# EasyEDA Pro project v_da-detector-v2.epro

# Schematic Schematic1
Board Name: Board1; Create Date: 2025-02-13; Page Name: P1; Project Name: v_da-detector; Schematic Name: Schematic1; Update Date: 2025-03-17; Company: EasyEDA.com; Page Size: A4; Version: V1.0
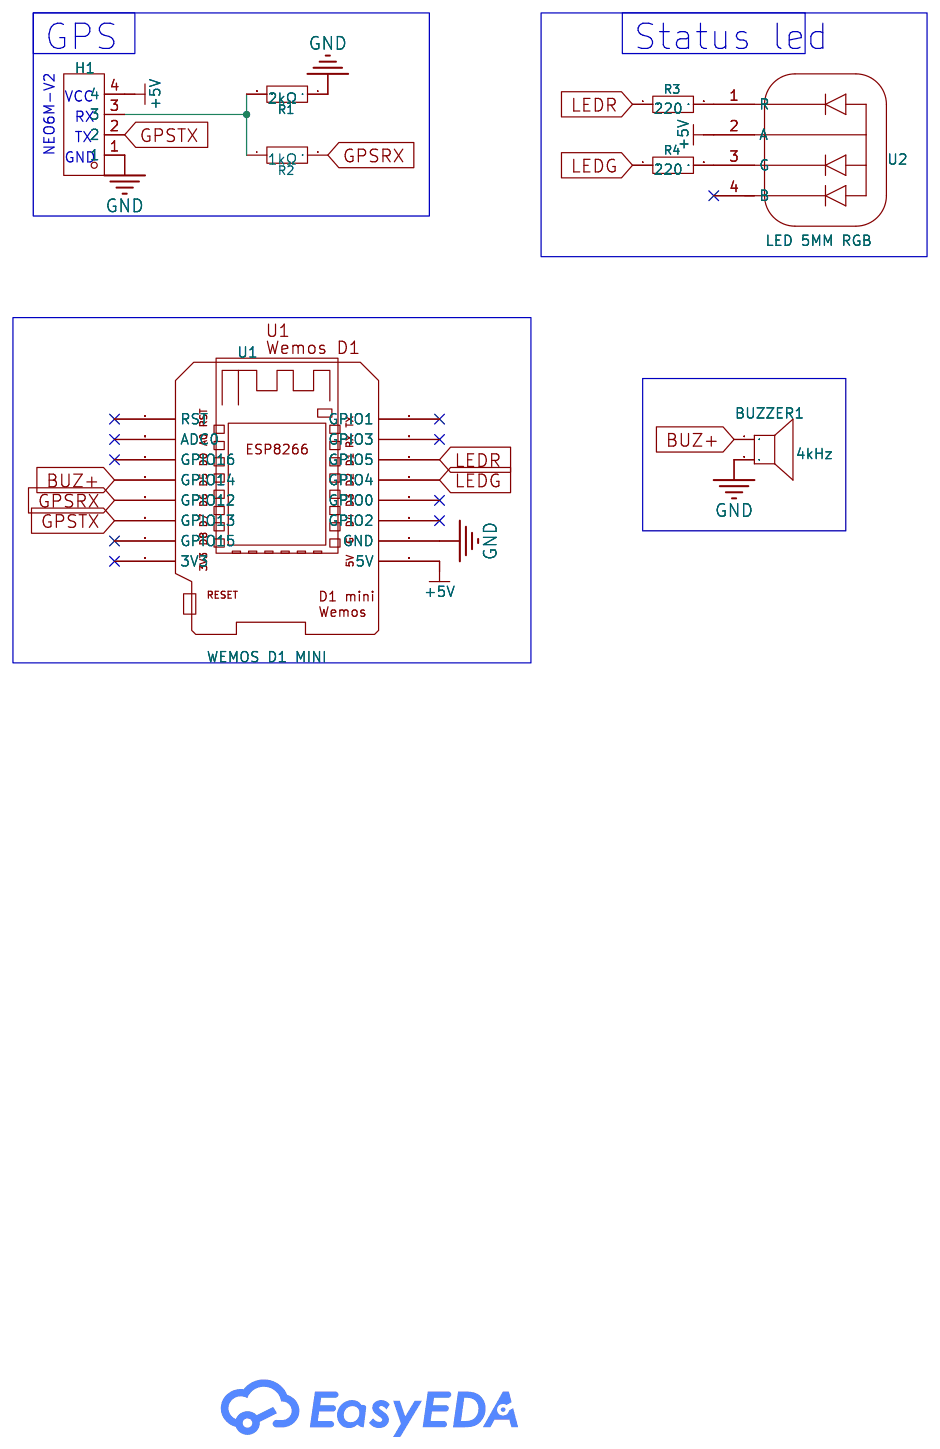
[diagram p0: schematic sheet]

## Parts
BUZZER1  4kHz  [BUZ-TH_BD12.5-P6.50-D0.9]
H1  -  [HDR-TH_4P-P2.54-V-M]
R1  2kΩ  [R0805]
R2  1kΩ  [R0805]
R3  220  [R0805]
R4  220  [R0805]
U1  WEMOS D1 MINI  [WEMOS-D1-MINI]
U2  LED 5MM RGB  [LED 5MM RGB TH]

## Library data of the parts
BUZZER1 = SFN-1207PA6.5: Driver Circuitry:Passive (external drive) Technology:Piezoelectric Frequency:4kHz Sound Pressure Level(SPL):80dB Diameter(φD):12.5mm Height:6.8mm; LCSC Part Name: 压电无源蜂鸣器; Supplier Part: C360618; Manufacturer: S&S(海旭); Supplier Footprint: 插件,D=12.5mm; JLCPCB Part Class: Extended Part; Datasheet: https://atta.szlcsc.com/upload/public/pdf/source/20190422/C360618_7771100601F1897510FDBBB3D1D2D84A.pdf; Supplier: LCSC; Driver Circuitry: Passive (external drive); Technology: Piezoelectric; Sound Pressure Level(SPL): 80dB; Diameter(φD): 12.5mm; Height: 6.8mm
H1 = HDR-M_2.54_1x4P: Supplier Footprint: Through
R1-R4 = 0805W8F1002T5E: Type:Thick Film Resistors Resistance:10kΩ Tolerance:±1% Tolerance:±1% Power(Watts): Overload Voltage (Max): Temperature Coefficient:±100ppm/℃ Temperature Coefficient:±100ppm/℃ Operating Temperature Range:-55℃~+155℃ Operating Temperature Range:-55℃~+155℃; LCSC Part Name: 10kΩ ±1% 125mW 厚膜电阻; Supplier Part: C17414; Manufacturer: UNI-ROYAL(厚声); Supplier Footprint: 0805; JLCPCB Part Class: Basic Part; Datasheet: https://atta.szlcsc.com/upload/public/pdf/source/20200306/C422600_1E6D84923E4A46A82E41ADD87F860B5C.pdf; Supplier: LCSC; Type: Thick Film Resistors; Tolerance: ±1%; Temperature Coefficient: ±100ppm/℃; Operating Temperature Range: -55℃~+155℃
U1 = WEMOS D1 MINI
U2 = LED 5MM RGB: Mounted: Yes

## Nets
+5V: H1.4 U1.5V U2.2(A)
GND: BUZZER1.2 H1.1 R1.1 U1.GND
BUZ+: BUZZER1.1 U1.D5(GPIO14)
GPSRX: R2.2 U1.D6(GPIO12)
GPSTX: H1.2 U1.D7(GPIO13)
LEDG: R4.1 U1.D2(GPIO4)
LEDR: R3.1 U1.D1(GPIO5)
Net-(H1-3): H1.3 R1.2 R2.1
Net-(R3-2): R3.2 U2.1(R)
Net-(R4-2): R4.2 U2.3(G)

Not connected (* = marked no-connect by the designer): U1 3V3* A0(ADC0)* D0(GPIO16)* D3(GPIO0)* D4(GPIO2)* D8(GPIO15)* RST* RX(GPIO3)* TX(GPIO1)*; U2 4(B)*

## Notes on the sheet
- GPS
- Status led
- NEO6M-V2
- VCC
- RX
- GND
- TX

# Board PCB2
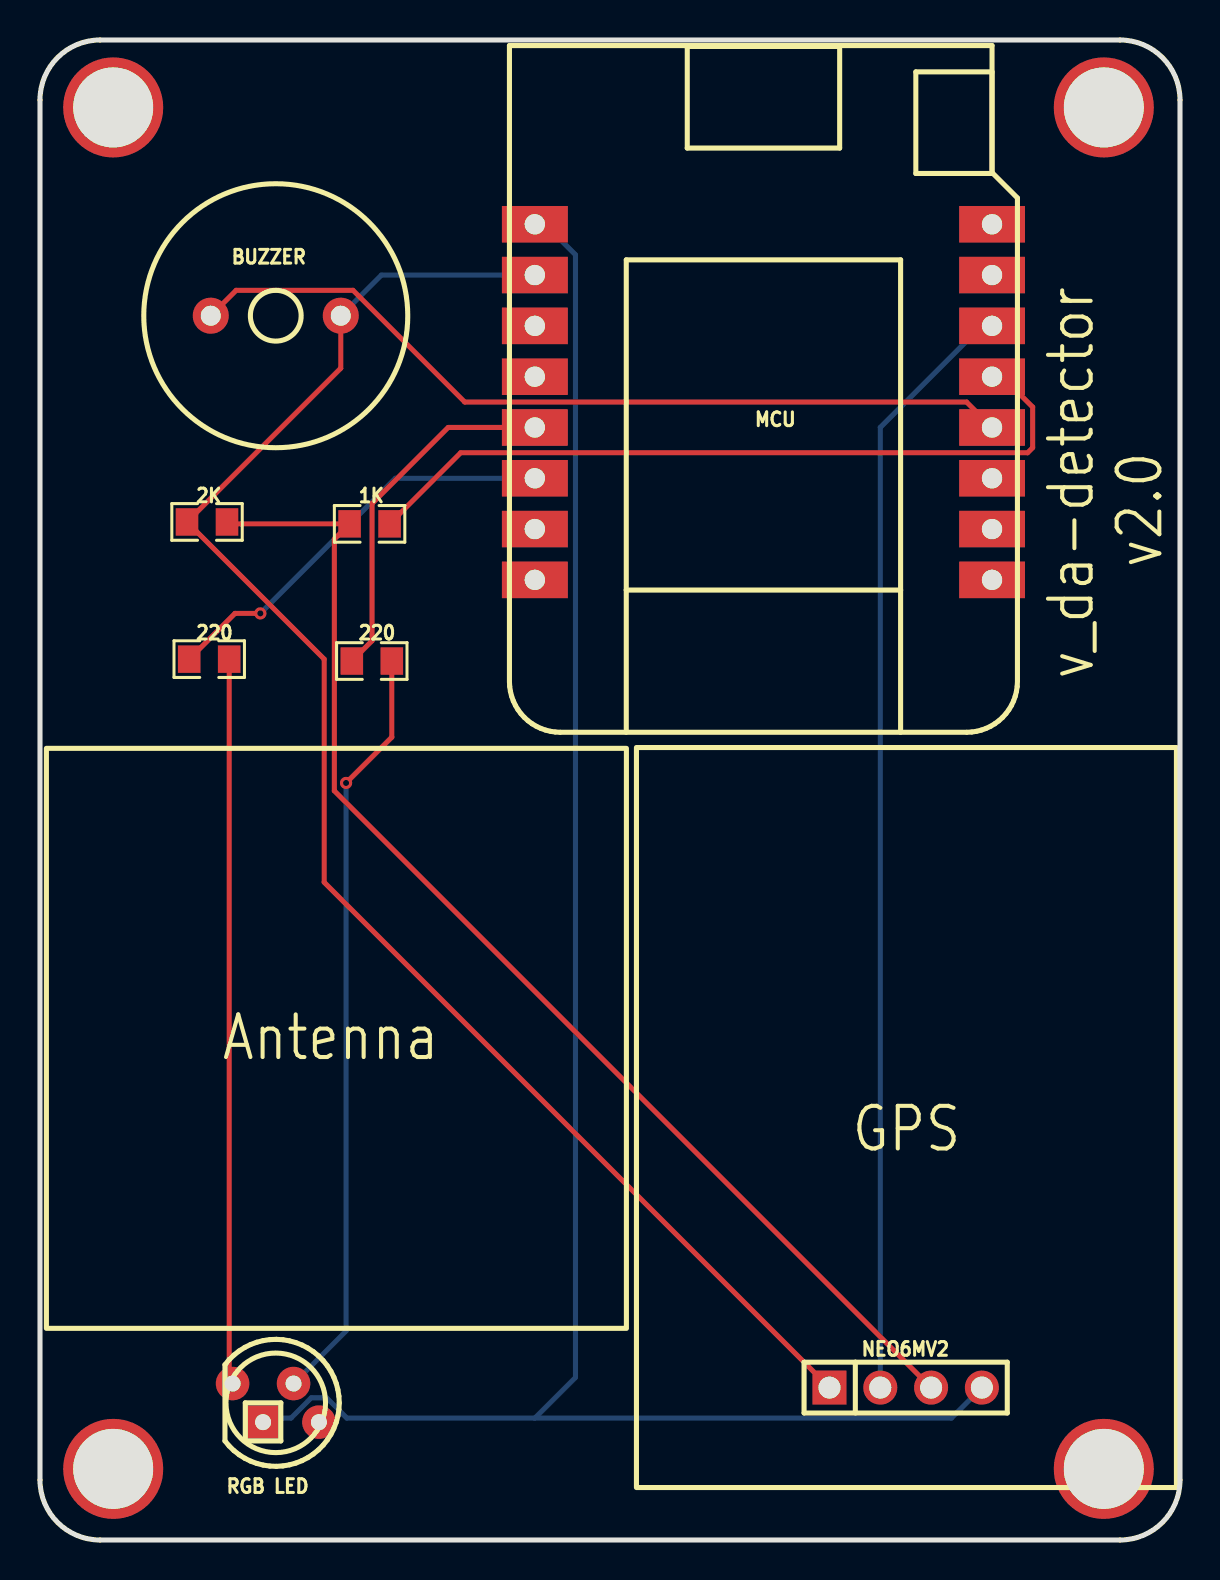
[diagram p1: board, top side]
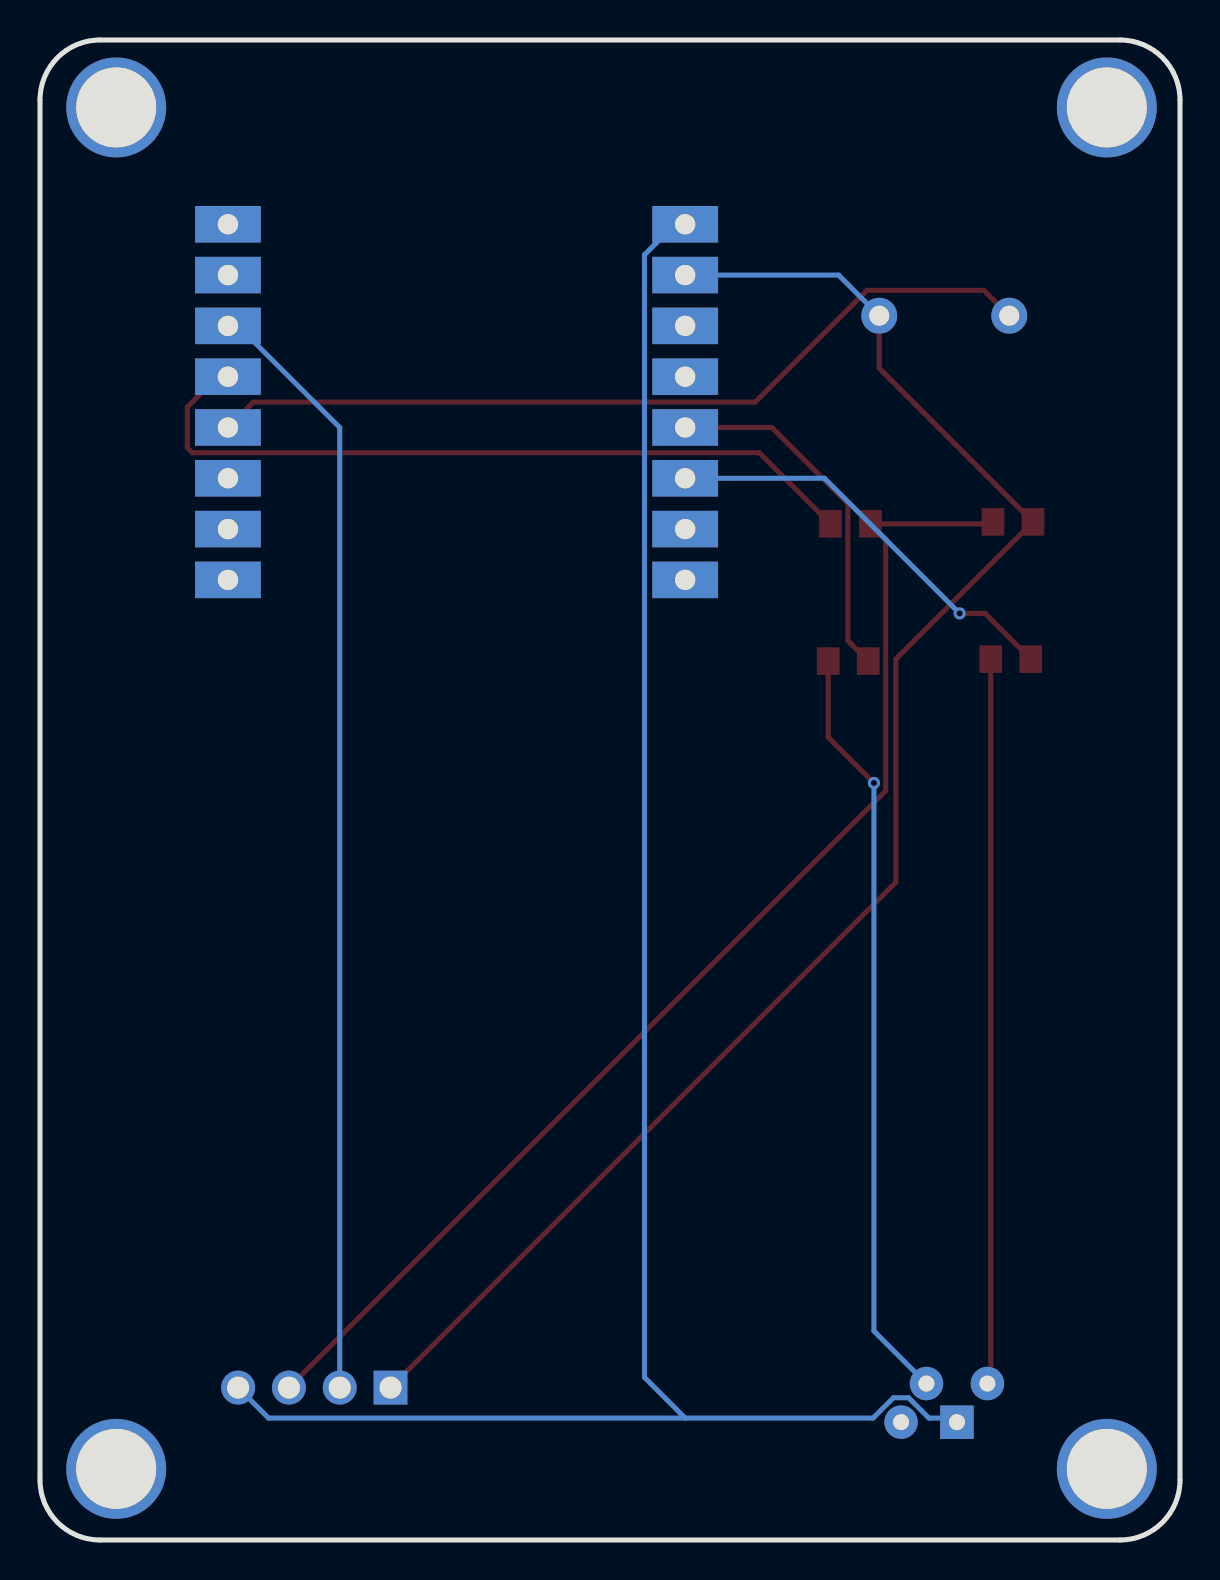
[diagram p2: board, bottom side, seen from below]

Outline 57 x 75 mm; copper layers: Top Layer, Bottom Layer. Coordinates in mm from the lower left corner of the outline.
Outline path: 0,72 0,3 arc(0.88,0.88) 3,0 54,0 arc(56.12,0.88) 57,3 57,72 arc(56.12,74.12) 54,75 3,75 arc(0.88,74.12) 0,72
Stack: Top Layer 0.035mm / Dielectric1 1.51mm FR4 er 4.5 / Bottom Layer 0.035mm

## Design rules (mm)
template: JLCPCB Capability(Two Layers Board)
spacing copperThickness1oz (default): track to track 0.102, other pairs 0.152 to 0.3
spacing copperThickness2oz: track to track 0.203, other pairs 0.152 to 0.3
track width copperThickness1oz (default): min 0.127, default 0.254, max 2.54
track width copperThickness2oz: min 0.203, default 0.254, max 2.54
differential pair differentialPair (default): width min 0.127, default 0.254, max 2.54; gap min 0.152, default 0.152
via viaSize (default): diameter min 0.5, default 0.61, max 10; hole min 0.3, default 0.305, max 6.3

## Placement (name value [footprint] x y rotation side)
1K  1kΩ  [R0805]  16.48 50.81 0 top
2K  2kΩ  [R0805]  8.35 50.9 0 top
220  -  [R0805]  16.59 43.95 0 top
220#2  -  [R0805]  8.46 44.04 0 top
BUZZER  4kHz  [BUZ-TH_BD12.5-P6.50-D0.9]  11.79 61.21 0 top
MCU  WEMOS D1 MINI  [WEMOS-D1-MINI]  36.17 56.9 90 top
NEO6MV2  -  [HDR-TH_4P-P2.54-V-M]  43.28 7.62 0 top
NOREF  -  [Pad_e8]  53.19 71.63 0 top
NOREF#2  -  [Pad_e5]  3.66 71.63 0 top
NOREF#3  -  [Pad_e9]  3.66 3.56 0 top
NOREF#4  -  [Pad_e7]  53.19 3.56 0 top
RGB LED  LED 5MM RGB  [LED 5MM RGB TH]  11.79 6.86 0 top

## Footprints (pads in the part's own frame, mm; a bottom-side part is the same pattern mirrored in y, then rotated)
BUZ-TH_BD12.5-P6.50-D0.9
  round 1.8 hole 1: 1(-3.25,0) 2(3.25,0)
HDR-TH_4P-P2.54-V-M
  rect 1.7x1.7 hole 1.1: 1(-3.81,0)
  round 1.7 hole 1.1: 2(-1.27,0) 3(1.27,0) 4(3.81,0)
LED 5MM RGB TH
  round 1.677 hole 0.797: 1(-2.159,0.965) 3(0.889,0.965) 4(2.159,-0.965)
  rect 1.677x1.677 hole 0.797: 2(-0.635,-0.965)
Pad_e5
  round 5 hole 4: 1(0,0)
Pad_e7
  round 5 hole 4: 1(0,0)
Pad_e8
  round 5 hole 4: 1(0,0)
Pad_e9
  round 5 hole 4: 1(0,0)
R0805
  rect 1.133x1.377 smd: 1(-1,0) 2(1,0)
WEMOS-D1-MINI
  rect 1.829x3.292 hole 1.016: 3V3(8.89,-11.43) 5V(8.89,11.43) A0(-6.35,-11.43) D0(-3.81,-11.43) D1(-3.81,11.43) D2(-1.27,11.43) D3(1.27,11.43) D4(3.81,11.43) D5(-1.27,-11.43) D6(1.27,-11.43) D7(3.81,-11.43) D8(6.35,-11.43) GND(6.35,11.43) RST(-8.89,-11.43) RX(-6.35,11.43) TX(-8.89,11.43)

## Nets
+5V: MCU.5V NEO6MV2.4 RGB LED.2
GND: 2K.1 BUZZER.2 MCU.GND NEO6MV2.1
BUZ+: BUZZER.1 MCU.D5
GPSRX: 1K.2 MCU.D6
GPSTX: MCU.D7 NEO6MV2.2
LEDG: 220.1 MCU.D2
LEDR: 220#2.1 MCU.D1
$1N3216: 1K.1 2K.2 NEO6MV2.3
$1N3703: 220.2 RGB LED.3
$1N3742: 220#2.2 RGB LED.1

Pads without a net: MCU 3V3 A0 D0 D3 D4 D8 RST RX TX; NOREF 1; NOREF#2 1; NOREF#3 1; NOREF#4 1; RGB LED 4

## Via types
v1: diameter 0.61, hole 0.305, Top Layer to Bottom Layer, 2 vias

## Routing (per net, layer and track width the routed paths; a pad name or vN(x,y) marks a point on that pad's centre or on a via; arc(x,y) is an arc through that point)
+5V: length 99.2
  Bottom Layer w0.254: NEO6MV2.4 45.57,6.1 24.74,6.1 ; 24.74,6.1 26.77,8.13 26.77,64.26 25.25,65.79 MCU.5V ; 24.74,6.1 15.34,6.1 14.33,7.11 13.57,7.11 12.55,6.1 11.36,6.1 11.15,5.89
GND: length 80.6
  Top Layer w0.254: NEO6MV2.1 14.21,32.89 14.21,44.04 2K.1 15.04,58.59 BUZZER.2
  Bottom Layer w0.254: BUZZER.2 17.07,63.25 MCU.GND
BUZ+: length 42.4
  Top Layer w0.254: MCU.D5 46.33,56.9 21.24,56.9 15.65,62.48 9.81,62.48 BUZZER.1
GPSRX: length 38.4
  Top Layer w0.254: MCU.D6 48.12,58.17 49.63,56.65 49.63,54.62 49.38,54.36 21.03,54.36 1K.2
GPSTX: length 55.7
  Bottom Layer w0.254: NEO6MV2.2 42.01,55.63 47.09,60.71 MCU.D7
LEDG: length 18
  Top Layer w0.254: MCU.D2 20.41,55.63 16.61,51.82 16.61,44.96 220.1
LEDR: length 21
  Top Layer w0.254: 220#2.1 9.75,46.33 v1(11.02,46.33)
  Bottom Layer w0.254: v1(11.02,46.33) 17.77,53.09 MCU.D1
$1N3216: length 62
  Top Layer w0.254: 2K.2 9.45,50.81 1K.1 14.72,50.04 14.72,37.46 NEO6MV2.3
$1N3703: length 38.2
  Top Layer w0.254: v1(15.3,37.85) 17.59,40.14 220.2
  Bottom Layer w0.254: 12.68,7.82 15.3,10.45 v1(15.3,37.85)
$1N3742: length 36.3
  Top Layer w0.254: 9.63,7.82 9.46,7.99 220#2.2

## Text on the board
Top Silkscreen Layer: Antenna | GPS | v_da-detector / v2.0
